# Altium schematic sheet бив2-bot_1b.SchDoc
size 209 x 297 mm; PageSetup: Record=PageOptions|CenterHorizontal=False|CenterVertical=False|PrintScale=0.96|XCorrection=0.00|YCorrection=0.00|PrintKind=1|BorderSize=5000000|LeftOffset=0|BottomOffset=0|Orientation=2|PaperLength=4200|PaperWidth=2970|Scale=100|PaperSource=7|PrintQuality=600|MediaType=1|DitherType=10|PaperKind=A3|PrintScaleMode=1; Rule: PcbType=ProtelPcb
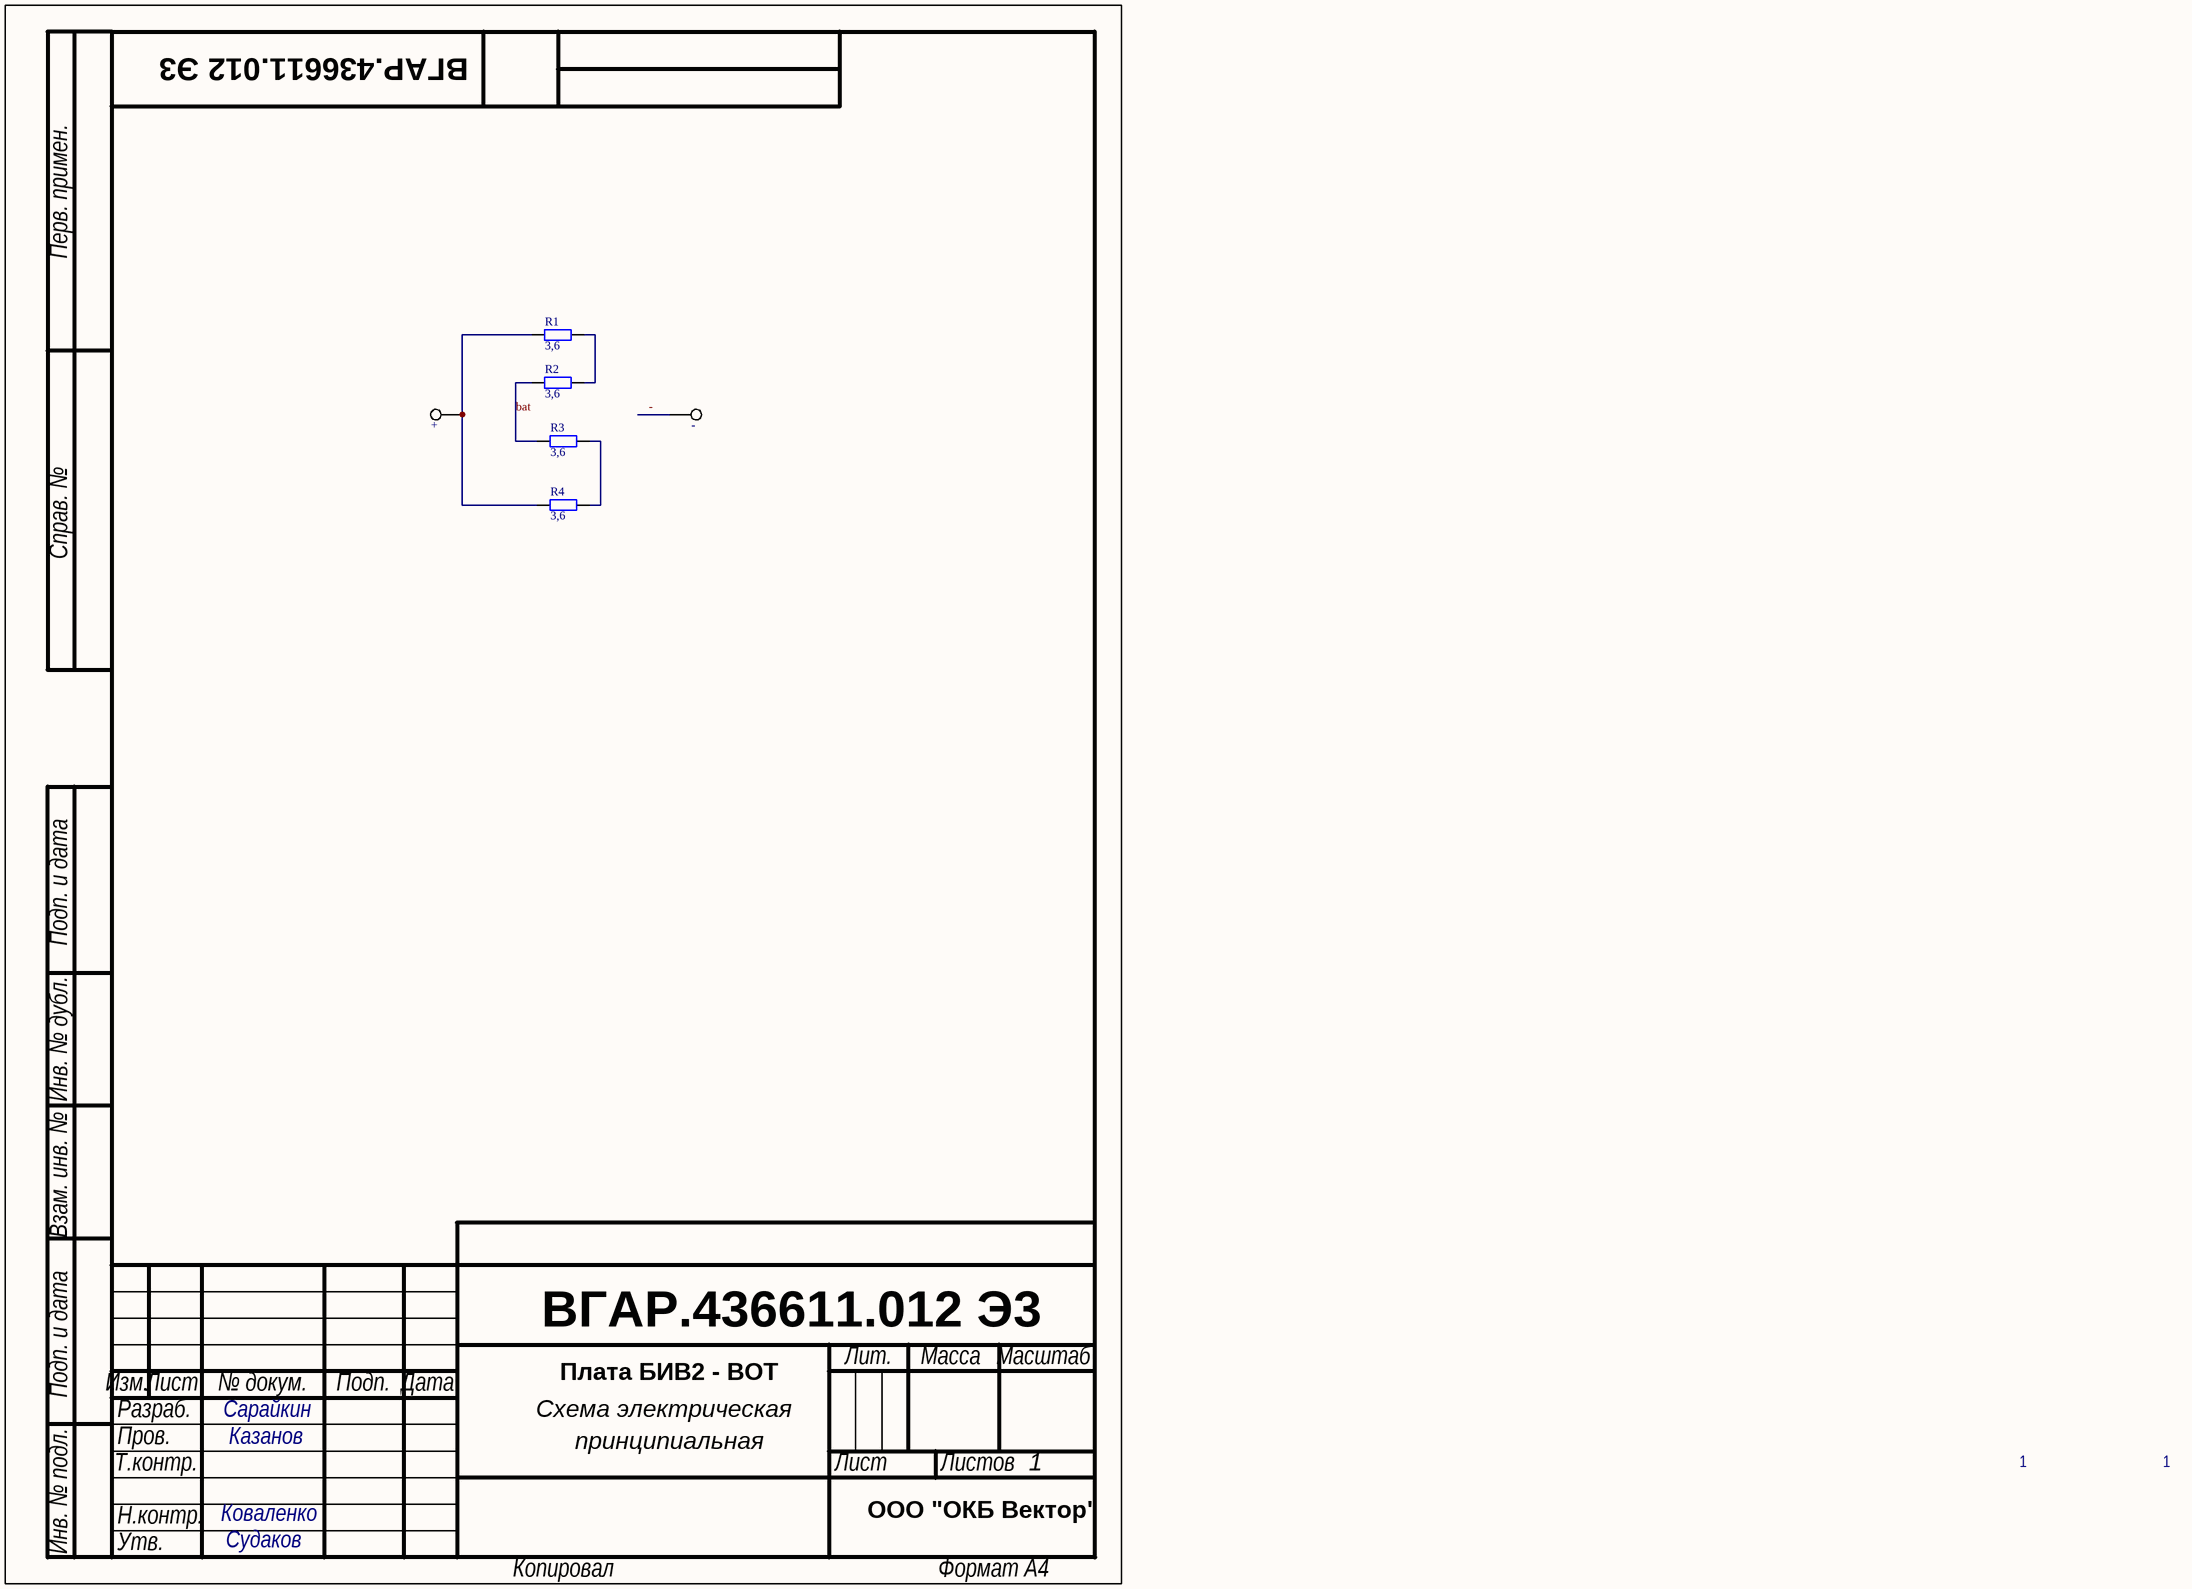
[diagram p0: бив2-bot_1b.SchDoc]

## Parts
+  Testpoint-TH-1.5mm  [1.5mm PAD]  (value not drawn)  (net tie, no BOM)
-  Testpoint-TH-1.5mm  [1.5mm PAD]  (value not drawn)  (net tie, no BOM)
R1  3,6  [RESC6432(2512)X06L]
R2  3,6  [RESC6432(2512)X06L]
R3  3,6  [RESC6432(2512)X06L]
R4  3,6  [RESC6432(2512)X06L]

## Nets
-: -.0
bat: R2.1 R3.1
Net+_0: +.0 R1.1 R4.1
NetR1_2: R1.2 R2.2
NetR3_2: R3.2 R4.2

## Notes on the sheet
- ВГАР.436611.012 Э3
- Плата БИВ2 - BOT
- Сарайкин
- Казанов
- Схема электрическая
- принципиальная
- 1
- Коваленко
- ООО "ОКБ Вектор"
- Судаков
- Перв. примен.
- Справ. №
- Подп. и дата
- Инв. № дубл.
- Взам. инв. №
- Изм.
- Лист
- № докум.
- Подп.
- Дата
- Лит.
- Масса
- Масштаб
- Т.контр.
- Пров.
- Разраб.
- Листов
- Инв. № подл.
- Н.контр.
- Утв.
- Копировал
- Формат А4

## Library data of the parts
+ - = Testpoint-TH-1.5mm: Dummy Pad
R1-R4 = R2512L: Резистор; Manufacturer: Bourns; PartNumber: 2512 - {Value} Ом ± 1 %; Max Rated DC Voltage: 400 В; Power: 1 Вт; Rated DC Voltage: 200 В; Rated T: -55 °C to +125 °C; TKR: ±100 ppm; Tolerance: ±1 %; Value: 10k; ComponentLink1Description: Data Sheet; ComponentLink1URL: http://smd.ru/files/upload/1207/ru/chip-resis.pdf; Case: 2512; ComponentLink2Description: Specific Res Only; ComponentLink2URL: *; ComponentLink3Description: Replacement Data Sheet; ComponentLink3URL: *; ComponentLink4Description: Replacement 2 Data Sheet; ComponentLink4URL: *; ReplacementPart1Manufacturer: *; ReplacementPart1PartNumber: *; ReplacementPart2Manufacturer: *; ReplacementPart2PartNumber: *; Temperature Range: -55 to +125°C